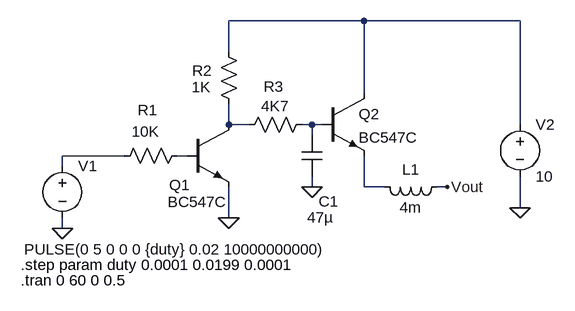
[diagram p0: schematic 0-10V.asc]
0-10V.asc, the LTspice schematic file:
Version 4.1
SHEET 1 880 680
WIRE 320 -64 112 -64
WIRE 560 -64 320 -64
WIRE 112 -16 112 -64
WIRE 320 48 320 -64
WIRE 112 96 112 64
WIRE 144 96 112 96
WIRE 240 96 224 96
WIRE 256 96 240 96
WIRE 560 96 560 -64
WIRE 240 112 240 96
WIRE -48 144 -144 144
WIRE 48 144 32 144
WIRE -144 160 -144 144
WIRE 240 192 240 176
WIRE 320 192 320 144
WIRE 352 192 320 192
WIRE 448 192 432 192
WIRE 560 224 560 176
WIRE 112 240 112 192
WIRE -144 256 -144 240
FLAG 112 240 0
FLAG 240 192 0
FLAG 448 192 Vout
FLAG -144 256 0
FLAG 560 224 0
SYMBOL res 48 128 R90
WINDOW 0 -39 61 VBottom 2
WINDOW 3 -37 64 VTop 2
SYMATTR InstName R1
SYMATTR Value 10K
SYMBOL res 96 -32 R0
WINDOW 0 -40 45 Left 2
WINDOW 3 -41 70 Left 2
SYMATTR InstName R2
SYMATTR Value 1K
SYMBOL res 240 80 R90
WINDOW 0 -27 59 VBottom 2
WINDOW 3 -28 57 VTop 2
SYMATTR InstName R3
SYMATTR Value 4K7
SYMBOL cap 224 112 R0
WINDOW 0 26 102 Left 2
WINDOW 3 9 127 Left 2
SYMATTR InstName C1
SYMATTR Value 47µ
SYMBOL npn 48 96 R0
WINDOW 0 -28 93 Left 2
WINDOW 3 -30 119 Left 2
SYMATTR InstName Q1
SYMATTR Value BC547C
SYMBOL npn 256 48 R0
SYMATTR InstName Q2
SYMATTR Value BC547C
SYMBOL voltage -144 144 R0
WINDOW 3 -59 144 Left 2
WINDOW 123 0 0 Left 0
WINDOW 39 0 0 Left 0
SYMATTR InstName V1
SYMATTR Value PULSE(0 5 0 0 0 {duty} 0.02 10000000000)
SYMBOL voltage 560 80 R0
WINDOW 123 0 0 Left 0
WINDOW 39 0 0 Left 0
SYMATTR InstName V2
SYMATTR Value 10
SYMBOL ind 448 176 R90
WINDOW 0 5 56 VBottom 2
WINDOW 3 32 56 VTop 2
SYMATTR InstName L1
SYMATTR Value 4m
TEXT -208 336 Left 2 !.tran 0 60 0 0.5
TEXT -208 312 Left 2 !.step param duty 0.0001 0.0199 0.0001

The netlist it stands for:
* 0-10V.asc
R1 N005 N004 10K
R2 N001 N002 1K
R3 N003 N002 4K7
C1 N003 0 47µ
Q1 N002 N005 0 0 BC547C
Q2 N001 N003 N006 0 BC547C
V1 N004 0 PULSE(0 5 0 0 0 {duty} 0.02 10000000000)
V2 N001 0 10
L1 Vout N006 4m
.model NPN NPN
.model PNP PNP
.lib standard.bjt
.tran 0 60 0 0.5
.step param duty 0.0001 0.0199 0.0001
.backanno
.end